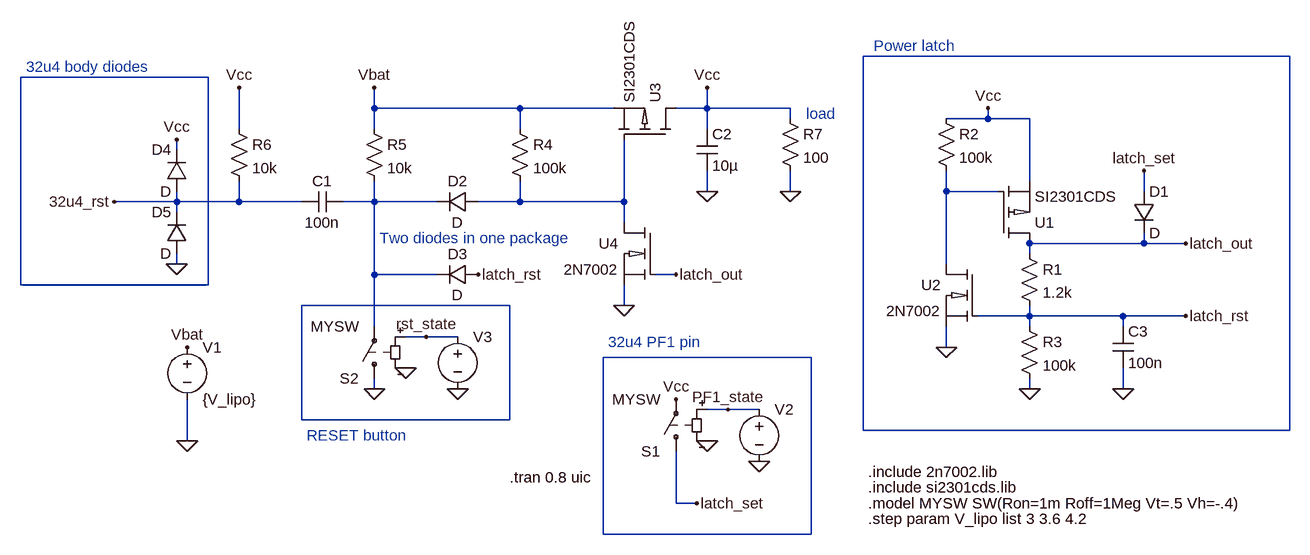
[diagram p0: schematic simulation.asc]
simulation.asc, the LTspice schematic file:
Version 4
SHEET 1 1624 700
WIRE 192 -256 -464 -256
WIRE -1472 -224 -1760 -224
WIRE -1216 -176 -1216 -208
WIRE -992 -176 -1216 -176
WIRE -848 -176 -992 -176
WIRE -704 -176 -704 -208
WIRE -704 -176 -752 -176
WIRE -576 -176 -704 -176
WIRE -576 -160 -576 -176
WIRE -272 -160 -272 -176
WIRE -272 -160 -336 -160
WIRE -208 -160 -272 -160
WIRE -1424 -144 -1424 -208
WIRE -1216 -144 -1216 -176
WIRE -992 -144 -992 -176
WIRE -704 -144 -704 -176
WIRE -1520 -112 -1520 -128
WIRE -208 -64 -208 -160
WIRE -704 -48 -704 -80
WIRE -576 -48 -576 -80
WIRE -336 -48 -336 -80
WIRE -256 -48 -336 -48
WIRE -32 -48 -32 -80
WIRE -1520 -32 -1520 -48
WIRE -1520 -32 -1616 -32
WIRE -1424 -32 -1424 -64
WIRE -1424 -32 -1520 -32
WIRE -1328 -32 -1424 -32
WIRE -1216 -32 -1216 -64
WIRE -1216 -32 -1264 -32
WIRE -1120 -32 -1216 -32
WIRE -992 -32 -992 -64
WIRE -992 -32 -1056 -32
WIRE -832 -32 -832 -128
WIRE -832 -32 -992 -32
WIRE -1520 -16 -1520 -32
WIRE -832 0 -832 -32
WIRE -32 32 -32 16
WIRE -32 32 -208 32
WIRE 32 32 -32 32
WIRE -208 48 -208 32
WIRE -1520 64 -1520 48
WIRE -336 64 -336 -48
WIRE -1216 80 -1216 -32
WIRE -1120 80 -1216 80
WIRE -752 80 -784 80
WIRE -1760 96 -1760 -224
WIRE -1472 96 -1472 -224
WIRE -1472 96 -1760 96
WIRE -1008 128 -1328 128
WIRE -832 128 -832 96
WIRE -208 144 -208 128
WIRE -208 144 -288 144
WIRE -64 144 -208 144
WIRE 32 144 -64 144
WIRE -1216 160 -1216 80
WIRE -208 160 -208 144
WIRE -64 160 -64 144
WIRE -1136 176 -1168 176
WIRE -1088 176 -1136 176
WIRE -336 192 -336 160
WIRE -544 208 -864 208
WIRE -1216 256 -1216 240
WIRE -208 256 -208 240
WIRE -64 256 -64 224
WIRE -672 288 -704 288
WIRE -624 288 -672 288
WIRE -1328 304 -1328 128
WIRE -1008 304 -1008 128
WIRE -1008 304 -1328 304
WIRE -464 320 -464 -256
WIRE 192 320 192 -256
WIRE 192 320 -464 320
WIRE -1504 336 -1504 272
WIRE -752 432 -752 352
WIRE -720 432 -752 432
WIRE -864 480 -864 208
WIRE -544 480 -544 208
WIRE -544 480 -864 480
FLAG -1504 336 0
FLAG -1504 192 Vbat
FLAG -272 -176 Vcc
FLAG -208 256 0
FLAG -336 192 0
FLAG -704 336 0
FLAG -624 368 0
FLAG -1168 224 0
FLAG -1088 256 0
FLAG -1216 256 0
FLAG -32 -80 latch_set
FLAG 32 32 latch_out
FLAG 32 144 latch_rst
FLAG -1216 -208 Vbat
FLAG -704 -208 Vcc
FLAG -1424 -208 Vcc
FLAG -1616 -32 32u4_rst
FLAG -1056 80 latch_rst
FLAG -832 128 0
FLAG -752 80 latch_out
FLAG -752 272 Vcc
FLAG -720 432 latch_set
FLAG -704 -48 0
FLAG -576 -48 0
FLAG -64 256 0
FLAG -1136 176 rst_state
FLAG -672 288 PF1_state
FLAG -1520 -128 Vcc
FLAG -1520 64 0
SYMBOL voltage -1504 176 R0
WINDOW 123 0 0 Left 0
WINDOW 39 24 124 Left 2
SYMATTR InstName V1
SYMATTR Value {V_lipo}
SYMBOL res -224 32 R0
SYMATTR InstName R1
SYMATTR Value 1.2k
SYMBOL res -352 -176 R0
SYMATTR InstName R2
SYMATTR Value 100k
SYMBOL res -224 144 R0
SYMATTR InstName R3
SYMATTR Value 100k
SYMBOL sw -752 368 R180
SYMATTR InstName S1
SYMATTR Value MYSW
SYMBOL voltage -624 272 R0
WINDOW 3 24 96 Invisible 2
WINDOW 123 0 0 Left 0
WINDOW 39 0 0 Left 0
SYMATTR Value PULSE(0 4.2 0.32 0.01m 0.01m 0.05 0.2 2)
SYMATTR InstName V2
SYMBOL sw -1216 256 R180
SYMATTR InstName S2
SYMATTR Value MYSW
SYMBOL voltage -1088 160 R0
WINDOW 3 24 96 Invisible 2
WINDOW 123 0 0 Left 0
WINDOW 39 0 0 Left 0
SYMATTR Value PULSE(0 4.2 0.1 0.01m 0.01m 0.03 0.2 4)
SYMATTR InstName V3
SYMBOL si2301cds -256 32 M180
SYMATTR InstName U1
SYMBOL diode -48 -48 R0
SYMATTR InstName D1
SYMBOL 2n7002 -288 64 M0
SYMATTR InstName U2
SYMBOL si2301cds -752 -128 M270
SYMATTR InstName U3
SYMBOL res -1008 -160 R0
SYMATTR InstName R4
SYMATTR Value 100k
SYMBOL res -1232 -160 R0
SYMATTR InstName R5
SYMATTR Value 10k
SYMBOL diode -1056 -48 R90
WINDOW 0 0 32 VBottom 2
WINDOW 3 32 32 VTop 2
SYMATTR InstName D2
SYMBOL cap -1264 -48 R90
WINDOW 0 0 32 VBottom 2
WINDOW 3 32 32 VTop 2
SYMATTR InstName C1
SYMATTR Value 100n
SYMBOL res -1440 -160 R0
SYMATTR InstName R6
SYMATTR Value 10k
SYMBOL diode -1056 64 R90
WINDOW 0 0 32 VBottom 2
WINDOW 3 32 32 VTop 2
SYMATTR InstName D3
SYMBOL 2n7002 -784 0 M0
SYMATTR InstName U4
SYMBOL cap -720 -144 R0
SYMATTR InstName C2
SYMATTR Value 10µ
SYMATTR SpiceLine Rser=0
SYMBOL cap -80 160 R0
SYMATTR InstName C3
SYMATTR Value 100n
SYMBOL diode -1504 -48 R180
WINDOW 0 24 64 Left 2
WINDOW 3 24 0 Left 2
SYMATTR InstName D4
SYMBOL diode -1504 48 R180
WINDOW 0 24 64 Left 2
WINDOW 3 24 0 Left 2
SYMATTR InstName D5
SYMBOL res -592 -176 R0
SYMATTR InstName R7
SYMATTR Value 100
TEXT -456 432 Left 2 !.model MYSW SW(Ron=1m Roff=1Meg Vt=.5 Vh=-.4)
TEXT -1008 392 Left 2 !.tran 0.8 uic
TEXT -456 408 Left 2 !.include si2301cds.lib
TEXT -448 -272 Left 2 ;Power latch
TEXT -456 384 Left 2 !.include 2n7002.lib
TEXT -1320 328 Left 2 ;RESET button
TEXT -856 184 Left 2 ;32u4 PF1 pin
TEXT -456 456 Left 2 !.step param V_lipo list 3 3.6 4.2
TEXT -1752 -240 Left 2 ;32u4 body diodes
TEXT -1208 24 Left 2 ;Two diodes in one package
TEXT -552 -168 Left 2 ;load

The netlist it stands for:
* simulation.asc
V1 Vbat 0 {V_lipo}
R1 latch_out latch_rst 1.2k
R2 Vcc N003 100k
R3 latch_rst 0 100k
S1 latch_set Vcc PF1_state 0 MYSW
V2 PF1_state 0 PULSE(0 4.2 0.32 0.01m 0.01m 0.05 0.2 2)
S2 0 N004 rst_state 0 MYSW
V3 rst_state 0 PULSE(0 4.2 0.1 0.01m 0.01m 0.03 0.2 4)
XU1 latch_out N003 Vcc SI2301CDS  ; pins D G S
D1 latch_set latch_out D
XU2 N003 latch_rst 0 2N7002  ; pins D G S
XU3 Vcc N005 Vbat SI2301CDS  ; pins D G S
R4 Vbat N005 100k
R5 Vbat N004 10k
D2 N005 N004 D
C1 N004 32u4_rst 100n
R6 Vcc 32u4_rst 10k
D3 latch_rst N004 D
XU4 N005 latch_out 0 2N7002  ; pins D G S
C2 Vcc 0 10µ Rser=0
C3 latch_rst 0 100n
D4 32u4_rst Vcc D
D5 0 32u4_rst D
R7 Vcc 0 100
.model D D
.lib standard.dio
.model MYSW SW(Ron=1m Roff=1Meg Vt=.5 Vh=-.4)
.tran 0.8 uic
.include si2301cds.lib
* Power latch
.include 2n7002.lib
* RESET button
* 32u4 PF1 pin
.step param V_lipo list 3 3.6 4.2
* 32u4 body diodes
* Two diodes in one package
* load
.backanno
.end